# Altium project PilotoAutomatico.PrjPCB
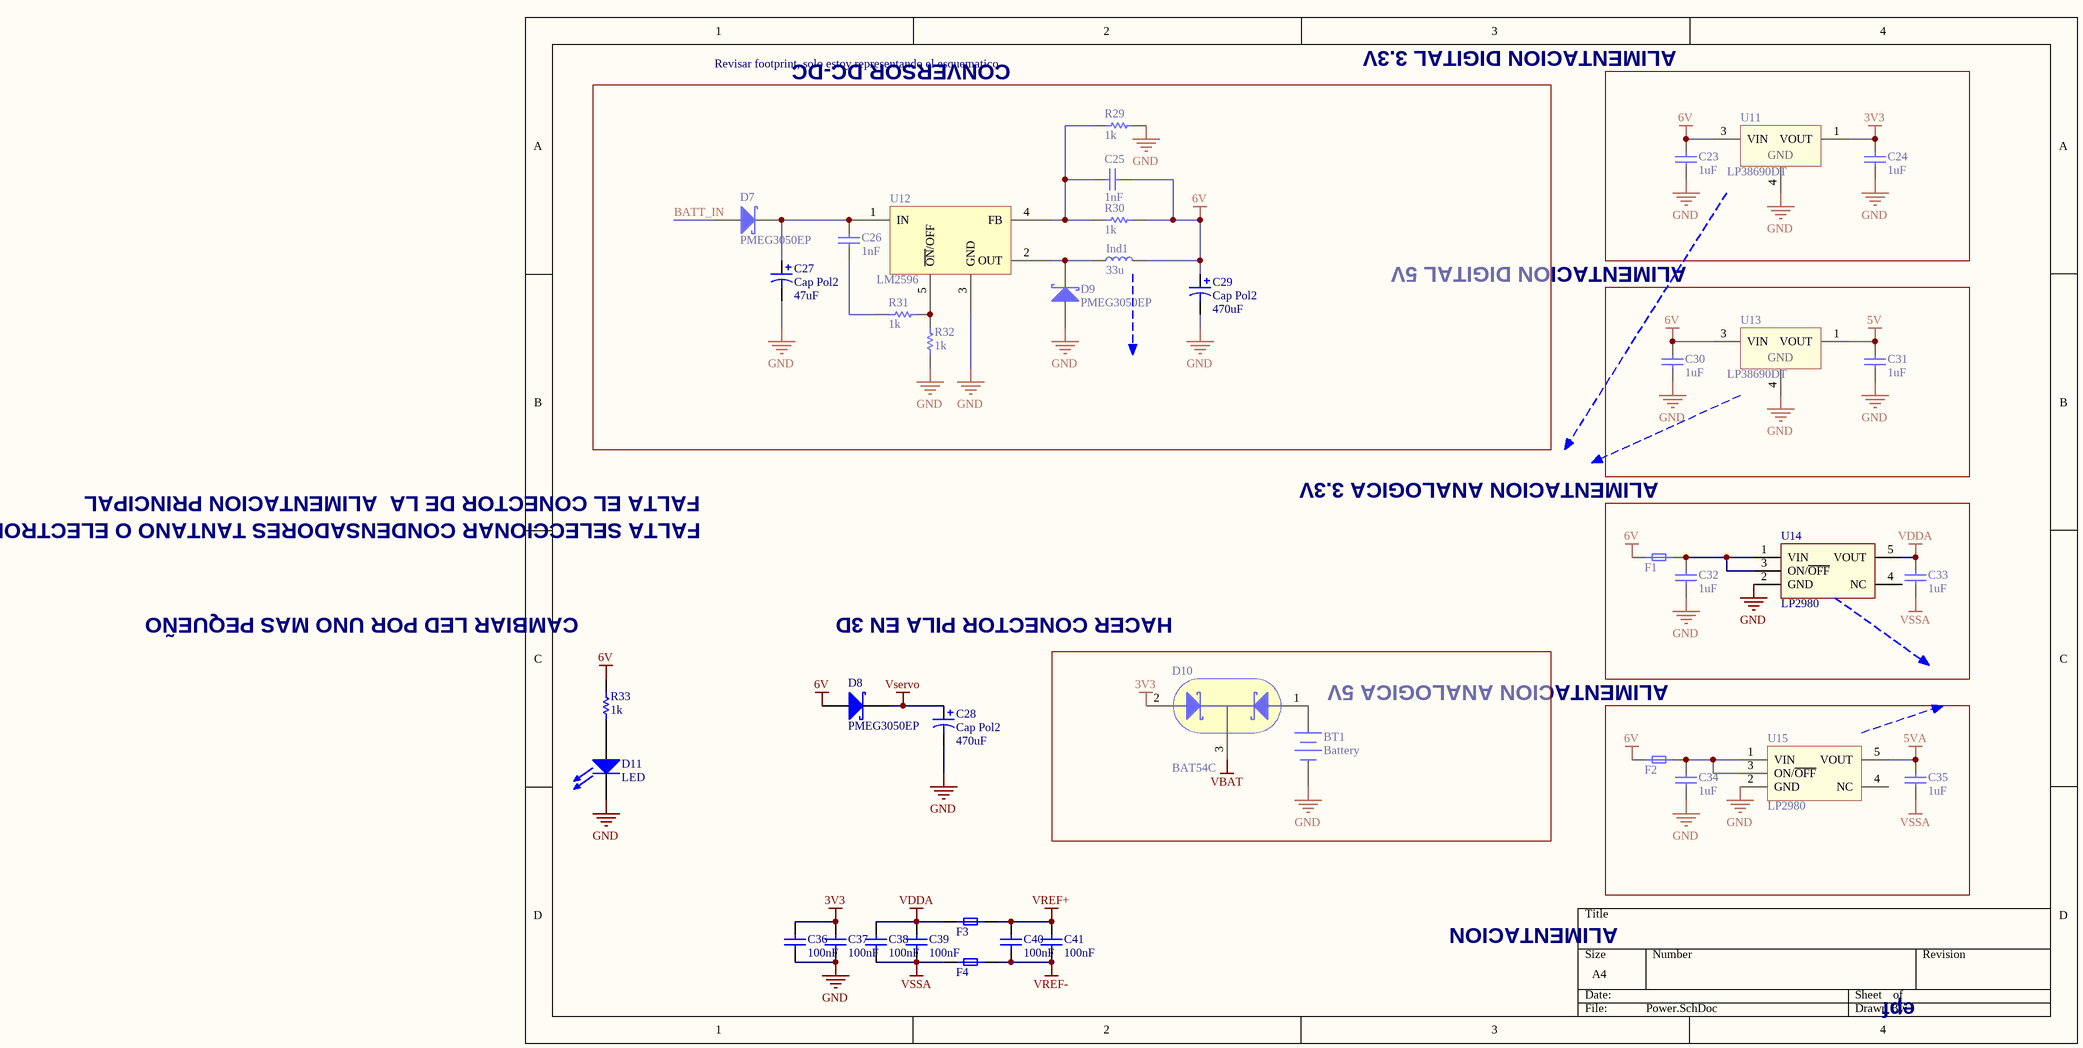
[diagram p0: Power.SchDoc]
autor: epf
6 sheets, 196 parts. Net scope: flat (ports and power ports of the same name join across sheets).
Board files: Autopilot_80x120.PcbDoc, Autopilot_60x120.PcbDoc, Autopilot_v0.PcbDoc
Sheets:
  Power.SchDoc
  Comunicaciones.SchDoc
  RC_Interface.SchDoc
  OSD y Memoria.SchDoc
  Sensores.SchDoc
  SensorDSC.SchDoc

## Sheet Power.SchDoc
size A4

### Parts
BT1  Battery  [BC501SM]
C23  value 1uF  [0805_CAP]  (hidden comment: Capacitor)
C24  value 1uF  [0805_CAP]  (hidden comment: Capacitor)
C25  value 1nF  [0805_CAP]  (hidden comment: Capacitor)
C26  value 1nF  [0805_CAP]  (hidden comment: Capacitor)
C27  Cap Pol2  value 47uF  [TC7360-2924]
C28  Cap Pol2  value 470uF  [TC7360-2924]
C29  Cap Pol2  value 470uF  [TC7360-2924]
C30  value 1uF  [0805_CAP]  (hidden comment: Capacitor)
C31  value 1uF  [0805_CAP]  (hidden comment: Capacitor)
C32  value 1uF  [CAP0402]  (hidden comment: Capacitor)
C33  value 1uF  [CAP0402]  (hidden comment: Capacitor)
C34  value 1uF  [CAP0402]  (hidden comment: Capacitor)
C35  value 1uF  [CAP0402]  (hidden comment: Capacitor)
C36  value 100nF  [CAP0402]  (hidden comment: Capacitor)
C37  value 100nF  [CAP0402]  (hidden comment: Capacitor)
C38  value 100nF  [CAP0402]  (hidden comment: Capacitor)
C39  value 100nF  [CAP0402]  (hidden comment: Capacitor)
C40  value 100nF  [CAP0402]  (hidden comment: Capacitor)
C41  value 100nF  [CAP0402]  (hidden comment: Capacitor)
D7  PMEG3050EP  [SOD128]
D8  PMEG3050EP  [SOD128]
D9  PMEG3050EP  [SOD128]
D10  BAT54C  [SOT23]
D11  LED  [PLCC-2Rojo]
F1  Ferrita  [IND0603]  (value not drawn)
F2  Ferrita  [IND0603]  (value not drawn)
F3  Ferrita  [IND0603]  (value not drawn)
F4  Ferrita  [IND0603]  (value not drawn)
Ind1  Valor: 33u  [CDRH127]  (hidden comment: Ind2)
R29  value 1k  [0805_RES]  (hidden comment: Resistor)
R30  value 1k  [0805_RES]  (hidden comment: Resistor)
R31  value 1k  [0805_RES]  (hidden comment: Resistor)
R32  value 1k  [0805_RES]  (hidden comment: Resistor)
R33  value 1k  [RES0402]  (hidden comment: Resistor)
U11  LP38690DT  [TO252-3N]
U12  LM2596  [TO-263 - LM2596]
U13  LP38690DT  [TO252-3N]
U14  LP2980  [SOT23-5BN]
U15  LP2980  [SOT23-5BN]

### Blocks framed on the sheet
Revisar footprint, solo estoy representando el esquematico: C25-C27 C29 D7 D9 Ind1 R29-R32 U12
ALIMENTACION DIGITAL 5V: C23 C24 U11
ALIMENTACION ANALOGICA 3.3V: C30 C31 U13
ALIMENTACION ANALOGICA 5V: C32 C33 F1 U14

### Nets
3V3: C24.2 C36.2 C37.2 D10.2(NC) U11.1(VOUT)
5V: C31.2 U13.1(VOUT)
5VA: C35.2 U15.5(VOUT)
6V: C23.2 C25.1 C29.1 C30.2 D8.2(A) F1.1 F2.1 Ind1.2 R30.2 R33.1 U11.3(VIN) U13.3(VIN)
GND: BT1.2(-) C23.1 C24.1 C27.2 C28.2 C29.2 C30.1 C31.1 C32.1 C34.1 C36.1 C37.1 D9.2(A) D11.2(K) R29.2 R32.1 U11.4(GND) U12.3(GND) U13.4(GND) U14.2(GND) U15.2(GND)
VBAT: D10.3(K)
VDDA: C33.2 C38.2 C39.2 F3.1 U14.5(VOUT)
VREF+: C40.2 C41.2 F3.2
VREF-: C40.1 C41.1 F4.2
Vservo: C28.1 D8.1(K)
VSSA: C33.1 C35.1 C38.1 C39.1 F4.1
BATT_IN: D7.2(A)
NetBT1_1: BT1.1(+) D10.1(A)
NetC25_2: C25.2 R29.1 R30.1 U12.4(FB)
NetC26_1: C26.1 R31.1
NetC26_2: C26.2 C27.1 D7.1(K) U12.1(IN)
NetC32_2: C32.2 F1.2 U14.1(VIN) U14.3(ON/~{OFF})
NetC34_2: C34.2 F2.2 U15.1(VIN) U15.3(ON/~{OFF})
NetD9_1: D9.1(K) Ind1.1 U12.2(OUT)
NetD11_1: D11.1(A) R33.2
NetR31_2: R31.2 R32.2 U12.5(~{ON}/OFF)

Not connected (* = marked no-connect by the designer): U14 4(NC); U15 4(NC)

### Notes on the sheet
- (near R29) CONVERSOR DC-DC
- ALIMENTACION DIGITAL 3.3V
- FALTA SELECCIONAR CONDENSADORES TANTANO O ELECTROLITICOS
- FALTA EL CONECTOR DE LA  ALIMENTACION PRINCIPAL
- CAMBIAR LED POR UNO MAS PEQUEÑO
- HACER CONECTOR PILA EN 3D
- ALIMENTACION
- epf

### Library data of the parts
BT1 = Battery: Multicell Battery; Published: 24-Mar-1999; LatestRevisionDate: 17-Jul-2002; LatestRevisionNote: Re-released for DXP Platform.; PackageReference: BAT-2; Publisher: Altium Limited
C23-C26 C30-C41 = Cap
C27-C29 = Cap Pol2: Polarized Capacitor (Axial); Published: 8-Jun-2000; LatestRevisionDate: 17-Jul-2002; LatestRevisionNote: Re-released for DXP Platform.; PackageReference: POLAR0.8; Publisher: Altium Limited
D7-D9 = PMEG3050EP: DIODO 5A DC-DC
D10 = BAT54C: Single schottky
D11 = LED1
R29-R33 = Res
U11 U13 = LP38690DT: Current 1A
U14 U15 = LP2980: Current 50mA

## Sheet Comunicaciones.SchDoc
size A4
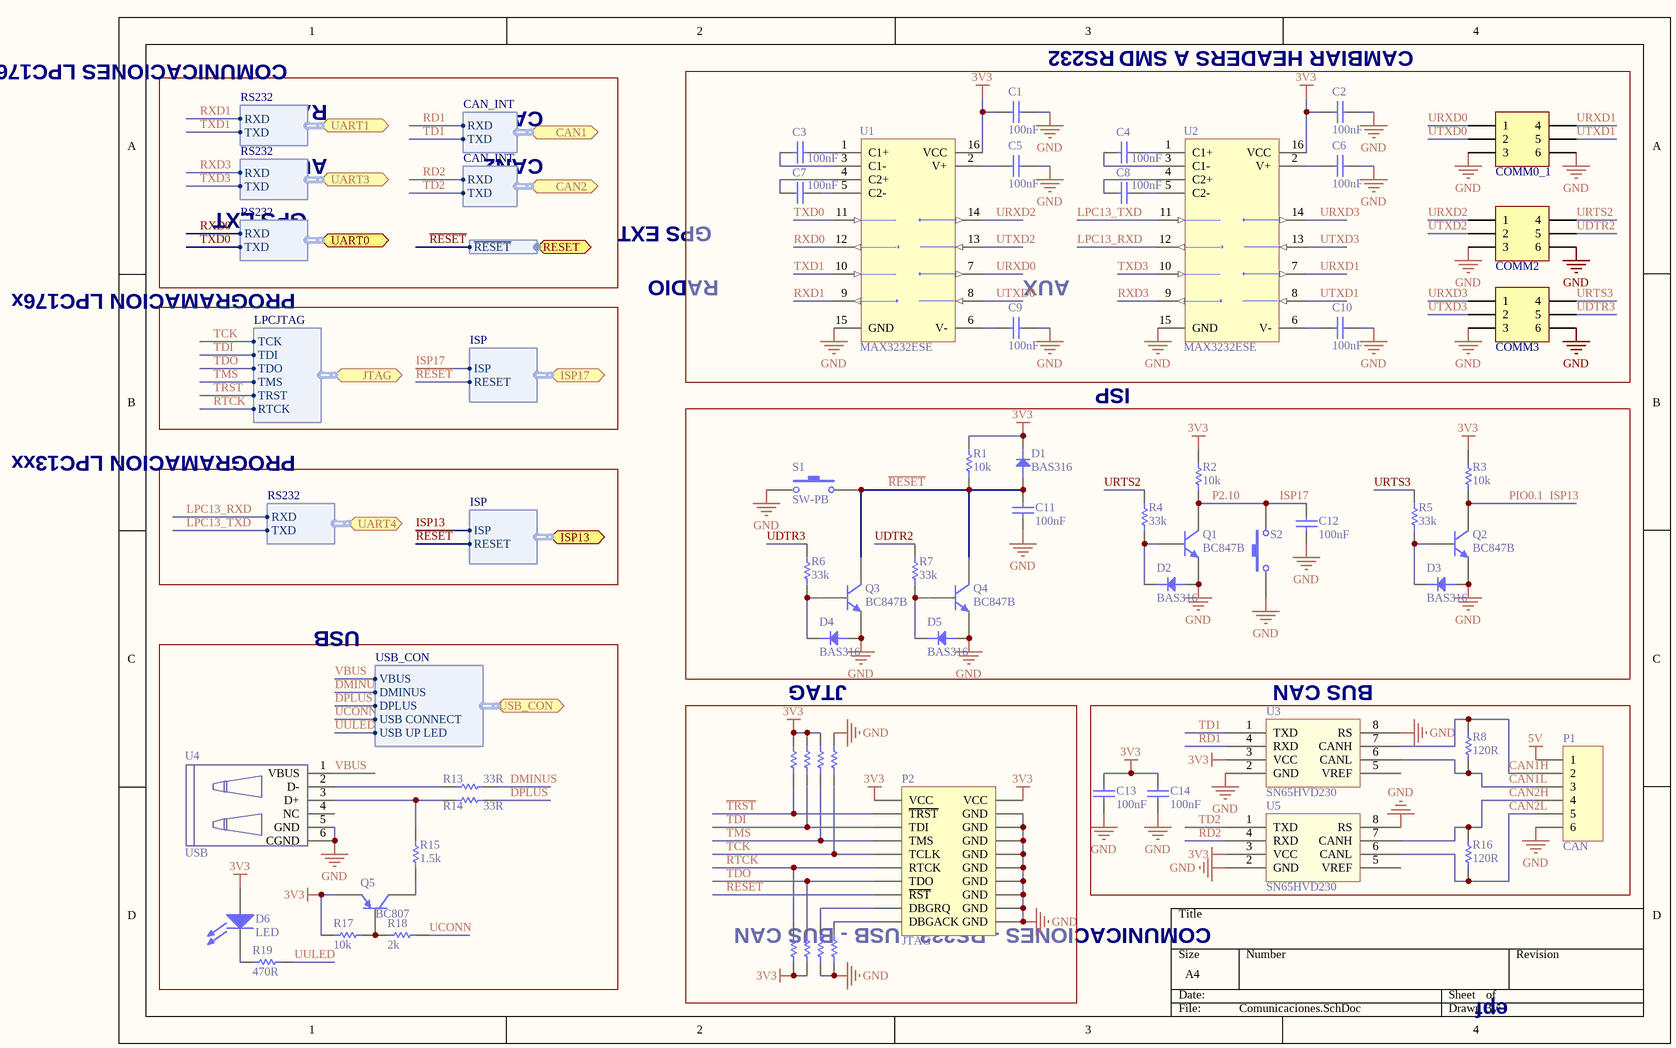
[diagram p1: Comunicaciones.SchDoc]

### Parts
C1  value 100nF  [CAP0402]  (hidden comment: Capacitor)
C2  value 100nF  [CAP0402]  (hidden comment: Capacitor)
C3  value 100nF  [CAP0402]  (hidden comment: Capacitor)
C4  value 100nF  [CAP0402]  (hidden comment: Capacitor)
C5  value 100nF  [CAP0402]  (hidden comment: Capacitor)
C6  value 100nF  [CAP0402]  (hidden comment: Capacitor)
C7  value 100nF  [CAP0402]  (hidden comment: Capacitor)
C8  value 100nF  [CAP0402]  (hidden comment: Capacitor)
C9  value 100nF  [CAP0402]  (hidden comment: Capacitor)
C10  value 100nF  [CAP0402]  (hidden comment: Capacitor)
C11  value 100nF  [CAP0402]  (hidden comment: Capacitor)
C12  value 100nF  [CAP0402]  (hidden comment: Capacitor)
C13  value 100nF  [CAP0402]  (hidden comment: Capacitor)
C14  value 100nF  [CAP0402]  (hidden comment: Capacitor)
COMM0_1  AP_COMM  [HDR2X3_CEN]  (value not drawn)
COMM2  AP_COMM  [HDR2X3_CEN]  (value not drawn)
COMM3  AP_COMM  [HDR2X3_CEN]  (value not drawn)
D1  BAS316  [SOD-323]
D2  BAS316  [SOD-323]
D3  BAS316  [SOD-323]
D4  BAS316  [SOD-323]
D5  BAS316  [SOD-323]
D6  LED  [PLCC-2Rojo]
P1  CAN  [HDR1X6]
P2  JTAG  [HDR2X10]
Q1  BC847B  [SOT23]
Q2  BC847B  [SOT23]
Q3  BC847B  [SOT23]
Q4  BC847B  [SOT23]
Q5  BC807  [SOT23]
R1  value 10k  [RES0402]  (hidden comment: Resistor)
R2  value 10k  [RES0402]  (hidden comment: Resistor)
R3  value 10k  [RES0402]  (hidden comment: Resistor)
R4  value 33k  [RES0402]  (hidden comment: Resistor)
R5  value 33k  [RES0402]  (hidden comment: Resistor)
R6  value 33k  [RES0402]  (hidden comment: Resistor)
R7  value 33k  [RES0402]  (hidden comment: Resistor)
R8  value 120R  [RES0402]  (hidden comment: Resistor)
R9  Resistor  [RES0402]  (value not drawn)
R10  Resistor  [RES0402]  (value not drawn)
R11  Resistor  [RES0402]  (value not drawn)
R12  Resistor  [RES0402]  (value not drawn)
R13  value 33R  [RES0402]  (hidden comment: Resistor)
R14  value 33R  [RES0402]  (hidden comment: Resistor)
R15  value 1.5k  [RES0402]  (hidden comment: Resistor)
R16  value 120R  [RES0402]  (hidden comment: Resistor)
R17  value 10k  [RES0402]  (hidden comment: Resistor)
R18  value 2k  [RES0402]  (hidden comment: Resistor)
R19  value 470R  [RES0402]  (hidden comment: Resistor)
R20  Resistor  [RES0402]  (value not drawn)
R21  Resistor  [RES0402]  (value not drawn)
R22  Resistor  [RES0402]  (value not drawn)
R23  Resistor  [RES0402]  (value not drawn)
S1  SW-PB  [SW-PB6mm - 2]
S2  SW-PB  [SW-PB6mm - 2]  (value not drawn)
U1  MAX3232ESE  [SOIC127P602-16BN]
U2  MAX3232ESE  [SOIC127P602-16BN]
U3  SN65HVD230  [SOIC127P600-8CN]
U4  USB  [USB/SM0.8-6H5]
U5  SN65HVD230  [SOIC127P600-8CN]

### Ports
CAN1 (harness CAN_INT), CAN2 (harness CAN_INT), ISP13 (harness ISP), ISP17 (harness ISP), JTAG (harness LPCJTAG), RESET (harness RESET), UART0 (harness RS232), UART1 (harness RS232), UART3 (harness RS232), UART4 (harness RS232), USB_CON (harness USB_CON)

### Harnesses
RS232: RXD, TXD
CAN_INT: RXD, TXD
LPCJTAG: TCK, TDI, TDO, TMS, TRST, RTCK
ISP: ISP, RESET
USB_CON: DMINUS, DPLUS, VBUS, USB CONNECT, USB UP LED
RESET: ~{RESET}

### Nets
3V3: C1.2 C2.2 C13.2 C14.2 D1.1(K) D6.1(A) P2.1(VCC) P2.2(VCC) Q5.2(E) R1.2 R2.2 R3.2 R9.1 R10.1 R11.1 R17.1 R20.2 R21.2 U1.16(VCC) U2.16(VCC) U3.3(VCC) U5.3(VCC)
5V: P1.1
GND: C1.1 C2.1 C5.1 C6.1 C9.1 C10.1 C11.2 C12.2 C13.1 C14.1 COMM0_1.3 COMM0_1.6 COMM2.3 COMM2.6 COMM3.3 COMM3.6 D2.2(A) D3.2(A) D4.2(A) D5.2(A) P1.6 P2.4(GND) P2.6(GND) P2.8(GND) P2.10(GND) P2.12(GND) P2.14(GND) P2.16(GND) P2.18(GND) P2.20(GND) Q1.2(E) Q2.2(E) Q3.2(E) Q4.2(E) R12.1 R22.2 R23.2 S1.1 S2.1 U1.15(GND) U2.15(GND) U3.2(GND) U3.8(RS) U4.5(GND) U4.6(CGND) U5.2(GND) U5.8(RS)
~{RESET}: C11.1 D1.2(A) P2.15(~{RST}) Q3.3(C) Q4.3(C) R1.1 S1.2 ; port ISP17.RESET, port ISP13.RESET, port RESET.~{RESET}
~{TRST}: P2.3(~{TRST}) R9.2 ; port JTAG.TRST
CAN1H: P1.2 R8.1 U3.7(CANH)
CAN1L: P1.3 R8.2 U3.6(CANL)
CAN2H: P1.4 R16.1 U5.7(CANH)
CAN2L: P1.5 R16.2 U5.6(CANL)
DMINUS: R13.2 ; port USB_CON.DMINUS
DPLUS: R14.2 ; port USB_CON.DPLUS
ISP13: Q2.3(C) R3.1 ; port ISP13.ISP  [also labelled PIO0.1]
ISP17: C12.1 Q1.3(C) R2.1 S2.2 ; port ISP17.ISP  [also labelled P2.10]
LPC13_RXD: U2.12(R1OUT) ; port UART4.RXD
LPC13_TXD: U2.11(T1IN) ; port UART4.TXD
RD1: U3.4(RXD) ; port CAN1.RXD
RD2: U5.4(RXD) ; port CAN2.RXD
RTCK: P2.11(RTCK) R20.1 ; port JTAG.RTCK
RXD0: U1.12(R1OUT) ; port UART0.RXD
RXD1: U1.9(R2OUT) ; port UART1.RXD
RXD3: U2.9(R2OUT) ; port UART3.RXD
TCK: P2.9(TCLK) R12.2 ; port JTAG.TCK
TD1: U3.1(TXD) ; port CAN1.TXD
TD2: U5.1(TXD) ; port CAN2.TXD
TDI: P2.5(TDI) R10.2 ; port JTAG.TDI
TDO: P2.13(TDO) R21.1 ; port JTAG.TDO
TMS: P2.7(TMS) R11.2 ; port JTAG.TMS
TXD0: U1.11(T1IN) ; port UART0.TXD
TXD1: U1.10(T2IN) ; port UART1.TXD
TXD3: U2.10(T2IN) ; port UART3.TXD
UCONN: R18.2 ; port USB_CON.USB CONNECT  [project net RXD2]
UDTR2: COMM2.5 R7.2
UDTR3: COMM3.5 R6.2
URTS2: COMM2.4 R4.2
URTS3: COMM3.4 R5.2
URXD0: COMM0_1.1 U1.7(T2OUT)
URXD1: COMM0_1.4 U2.7(T2OUT)
URXD2: COMM2.1 U1.14(T1OUT)
URXD3: COMM3.1 U2.14(T1OUT)
UTXD0: COMM0_1.2 U1.8(R2IN)
UTXD1: COMM0_1.5 U2.8(R2IN)
UTXD2: COMM2.2 U1.13(R1IN)
UTXD3: COMM3.2 U2.13(R1IN)
UULED: R19.2 ; port USB_CON.USB UP LED
VBUS: U4.1(VBUS) ; port USB_CON.VBUS
NetC3_1: C3.1 U1.1(C1+)
NetC3_2: C3.2 U1.3(C1-)
NetC4_1: C4.1 U2.1(C1+)
NetC4_2: C4.2 U2.3(C1-)
NetC5_2: C5.2 U1.2(V+)
NetC6_2: C6.2 U2.2(V+)
NetC7_1: C7.1 U1.5(C2-)
NetC7_2: C7.2 U1.4(C2+)
NetC8_1: C8.1 U2.5(C2-)
NetC8_2: C8.2 U2.4(C2+)
NetC9_2: C9.2 U1.6(V-)
NetC10_2: C10.2 U2.6(V-)
NetD2_1: D2.1(K) Q1.1(B) R4.1
NetD3_1: D3.1(K) Q2.1(B) R5.1
NetD4_1: D4.1(K) Q3.1(B) R6.1
NetD5_1: D5.1(K) Q4.1(B) R7.1
NetD6_2: D6.2(K) R19.1
NetP2_17: P2.17(DBGRQ) R22.1
NetP2_19: P2.19(DBGACK) R23.1
NetQ5_1: Q5.1(B) R17.2 R18.1
NetQ5_3: Q5.3(C) R15.2
NetR13_1: R13.1 U4.2(D-)
NetR14_1: R14.1 R15.1 U4.3(D+)

Not connected (* = marked no-connect by the designer): U3 5(VREF); U4 4(NC); U5 5(VREF)

### Notes on the sheet
- COMUNICACIONES LPC176x
- RS232
- CAMBIAR HEADERS A SMD
- RADIO
- CAN1
- AUX
- CAN2
- GPS EXT
- (near C7) GPS EXT
- PROGRAMACION LPC176x
- ISP
- PROGRAMACION LPC13xx
- USB
- JTAG
- BUS CAN
- COMUNICACIONES - RS232 - USB - BUS CAN
- epf

### Library data of the parts
C1-C14 = Cap
COMM0_1 COMM2 COMM3 = AP_COMM: Header, 3-Pin, Dual row; LatestRevisionDate: 17-Jul-2002; LatestRevisionNote: Re-released for DXP Platform.; Publisher: Altium Limited
D6 = LED1
P1 = CAN_Conn: Header, 6-Pin; LatestRevisionDate: 17-Jul-2002; LatestRevisionNote: Re-released for DXP Platform.; Publisher: Altium Limited
P2 = JTAG: Header, 10-Pin, Dual row; LatestRevisionDate: 17-Jul-2002; LatestRevisionNote: Re-released for DXP Platform.; Publisher: Altium Limited
Q1-Q4 = BC847B: NPN 100MHz
Q5 = BC807: PNP 100MHz
R1-R8 R13-R19 = Res
R9-R12 R20-R23 = Res: Value: 10k
S1 S2 = SW-PB: Switch; Published: 24-Mar-1999; LatestRevisionDate: 17-Jul-2002; LatestRevisionNote: Re-released for DXP Platform.; PackageReference: SPST-2; Publisher: Altium Limited
U1 U2 = MAX3232ESE+
U3 U5 = SN65HVD230: 3.3-V CAN TRANSCEIVERS
U4 = USB-miniB

## Sheet RC_Interface.SchDoc
size A4
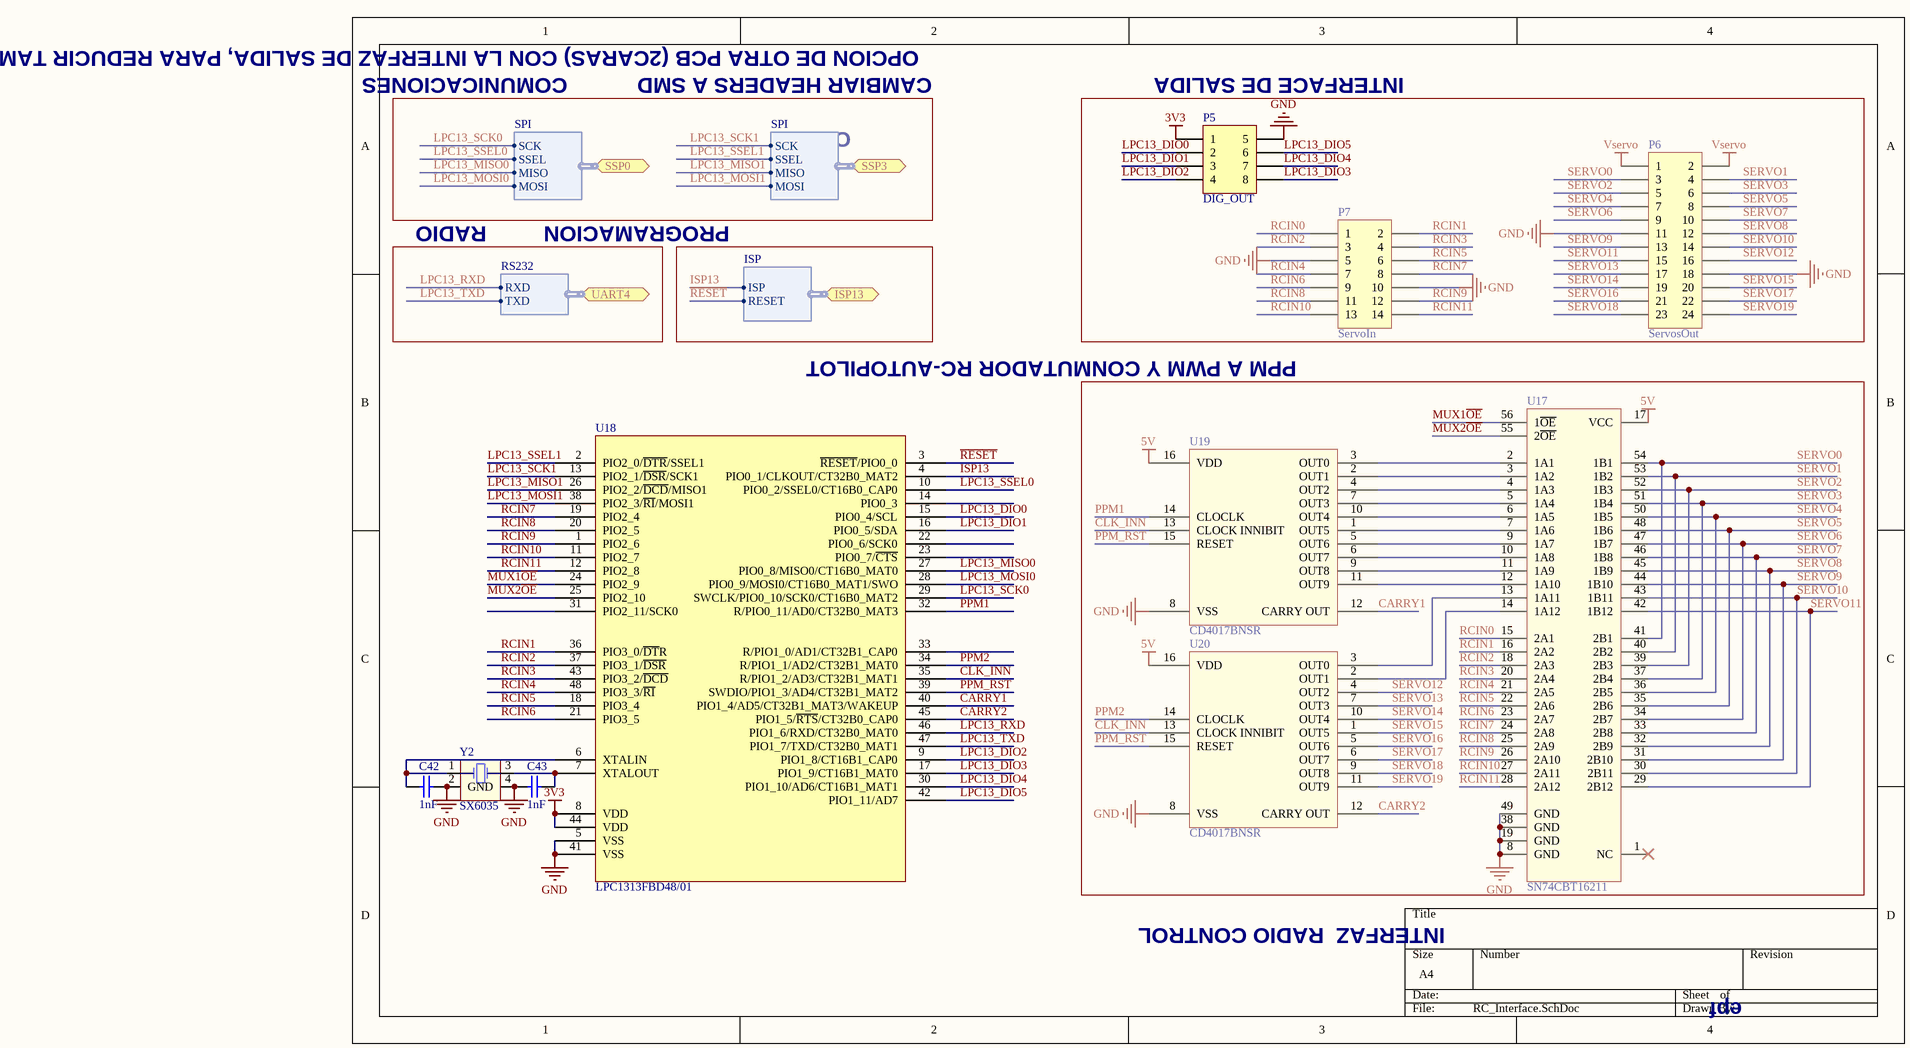
[diagram p2: RC_Interface.SchDoc]

### Parts
C42  value 1nF  [CAP0402]  (hidden comment: Capacitor)
C43  value 1nF  [CAP0402]  (hidden comment: Capacitor)
P5  DIG_OUT  [HDR2X4_CEN]
P6  ServosOut  [HDR 2X12]
P7  ServoIn  [HDR2X7]
U17  SN74CBT16211  [SOP635P1035-56N]
U18  LPC1313FBD48/01  [TQFP48_LPC1343]
U19  CD4017BNSR  [SOIC127P602-16BN]
U20  CD4017BNSR  [SOIC127P602-16BN]
Y2  SX6035  [SX6035]

### Ports
ISP13 (harness ISP), SSP0 (harness SPI), SSP3 (harness SPI), UART4 (harness RS232)

### Harnesses
SPI: SCK, SSEL, MISO, MOSI
RS232: RXD, TXD
ISP: ISP, RESET

### Nets
3V3: P5.1 U18.8(VDD) U18.44(VDD)
5V: U17.17(VCC) U19.16(VDD) U20.16(VDD)
GND: C42.1 C43.2 P5.5 P6.11 P6.18 P7.5 P7.10 U17.8(GND) U17.19(GND) U17.38(GND) U17.49(GND) U18.5(VSS) U18.41(VSS) U19.8(VSS) U20.8(VSS) Y2.2(GND) Y2.4(GND)
Vservo: P6.1 P6.2
~{RESET}: U18.3(~{RESET}/PIO0_0) ; port ISP13.RESET
CARRY1: U18.40(PIO1_4/AD5/CT32B1_MAT3/WAKEUP) U19.12(CARRY_OUT)
CARRY2: U18.45(PIO1_5/~{RTS}/CT32B0_CAP0) U20.12(CARRY_OUT)
CLK_INN: U18.35(R/PIO1_2/AD3/CT32B1_MAT1) U19.13(CLOCK_INNIBIT) U20.13(CLOCK_INNIBIT)
ISP13: U18.4(PIO0_1/CLKOUT/CT32B0_MAT2) ; port ISP13.ISP
LPC13_DIO0: P5.2 U18.15(PIO0_4/SCL)
LPC13_DIO1: P5.3 U18.16(PIO0_5/SDA)
LPC13_DIO2: P5.4 U18.9(PIO1_8/CT16B1_CAP0)
LPC13_DIO3: P5.8 U18.17(PIO1_9/CT16B1_MAT0)
LPC13_DIO4: P5.7 U18.30(PIO1_10/AD6/CT16B1_MAT1)
LPC13_DIO5: P5.6 U18.42(PIO1_11/AD7)
LPC13_MISO0: U18.27(PIO0_8/MISO0/CT16B0_MAT0) ; port SSP0.MISO
LPC13_MISO1: U18.26(PIO2_2/~{DCD}/MISO1) ; port SSP3.MISO
LPC13_MOSI0: U18.28(PIO0_9/MOSI0/CT16B0_MAT1/SWO) ; port SSP0.MOSI
LPC13_MOSI1: U18.38(PIO2_3/~{RI}/MOSI1) ; port SSP3.MOSI
LPC13_RXD: U18.46(PIO1_6/RXD/CT32B0_MAT0) ; port UART4.RXD
LPC13_SCK0: U18.29(SWCLK/PIO0_10/SCK0/CT16B0_MAT2) ; port SSP0.SCK
LPC13_SCK1: U18.13(PIO2_1/~{DSR}/SCK1) ; port SSP3.SCK
LPC13_SSEL0: U18.10(PIO0_2/SSEL0/CT16B0_CAP0) ; port SSP0.SSEL
LPC13_SSEL1: U18.2(PIO2_0/~{DTR}/SSEL1) ; port SSP3.SSEL
LPC13_TXD: U18.47(PIO1_7/TXD/CT32B0_MAT1) ; port UART4.TXD
MUX1~{OE}: U17.56(1~{OE}) U18.24(PIO2_9)
MUX2~{OE}: U17.55(2~{OE}) U18.25(PIO2_10)
PPM1: U18.32(R/PIO0_11/AD0/CT32B0_MAT3) U19.14(CLOCLK)
PPM2: U18.34(R/PIO1_1/AD2/CT32B1_MAT0) U20.14(CLOCLK)
PPM_RST: U18.39(SWDIO/PIO1_3/AD4/CT32B1_MAT2) U19.15(RESET) U20.15(RESET)
RCIN0: P7.1 U17.15(2A1)
RCIN1: P7.2 U17.16(2A2) U18.36(PIO3_0/~{DT}R)
RCIN2: P7.3 U17.18(2A3) U18.37(PIO3_1/~{DSR})
RCIN3: P7.4 U17.20(2A4) U18.43(PIO3_2/~{DCD})
RCIN4: P7.7 U17.21(2A5) U18.48(PIO3_3/~{RI})
RCIN5: P7.6 U17.22(2A6) U18.18(PIO3_4)
RCIN6: P7.9 U17.23(2A7) U18.21(PIO3_5)
RCIN7: P7.8 U17.24(2A8) U18.19(PIO2_4)
RCIN8: P7.11 U17.25(2A9) U18.20(PIO2_5)
RCIN9: P7.12 U17.26(2A10) U18.1(PIO2_6)
RCIN10: P7.13 U17.27(2A11) U18.11(PIO2_7)
RCIN11: P7.14 U17.28(2A12) U18.12(PIO2_8)
SERVO0: P6.3 U17.41(2B1) U17.54(1B1)
SERVO1: P6.4 U17.40(2B2) U17.53(1B2)
SERVO2: P6.5 U17.39(2B3) U17.52(1B3)
SERVO3: P6.6 U17.37(2B4) U17.51(1B4)
SERVO4: P6.7 U17.36(2B5) U17.50(1B5)
SERVO5: P6.8 U17.35(2B6) U17.48(1B6)
SERVO6: P6.9 U17.34(2B7) U17.47(1B7)
SERVO7: P6.10 U17.33(2B8) U17.46(1B8)
SERVO8: P6.12 U17.32(2B9) U17.45(1B9)
SERVO9: P6.13 U17.31(2B10) U17.44(1B10)
SERVO10: P6.14 U17.30(2B11) U17.43(1B11)
SERVO11: P6.15 U17.29(2B12) U17.42(1B12)
SERVO12: P6.16 U20.4(OUT2)
SERVO13: P6.17 U20.7(OUT3)
SERVO14: P6.19 U20.10(OUT4)
SERVO15: P6.20 U20.1(OUT5)
SERVO16: P6.21 U20.5(OUT6)
SERVO17: P6.22 U20.6(OUT7)
SERVO18: P6.23 U20.9(OUT8)
SERVO19: P6.24 U20.11(OUT9)
NetC42_2: C42.2 U18.6(XTALIN) Y2.1(XTAL)
NetC43_1: C43.1 U18.7(XTALOUT) Y2.3(XTAL)
NetU17_2: U17.2(1A1) U19.3(OUT0)
NetU17_3: U17.3(1A2) U19.2(OUT1)
NetU17_4: U17.4(1A3) U19.4(OUT2)
NetU17_5: U17.5(1A4) U19.7(OUT3)
NetU17_6: U17.6(1A5) U19.10(OUT4)
NetU17_7: U17.7(1A6) U19.1(OUT5)
NetU17_9: U17.9(1A7) U19.5(OUT6)
NetU17_10: U17.10(1A8) U19.6(OUT7)
NetU17_11: U17.11(1A9) U19.9(OUT8)
NetU17_12: U17.12(1A10) U19.11(OUT9)
NetU17_13: U17.13(1A11) U20.3(OUT0)
NetU17_14: U17.14(1A12) U20.2(OUT1)

Not connected (* = marked no-connect by the designer): U17 1(NC)*; U18 14(PIO0_3) 22(PIO0_6/SCK0) 23(PIO0_7/~{CTS}) 31(PIO2_11/SCK0) 33(R/PIO1_0/AD1/CT32B1_CAP0)

### Notes on the sheet
- OPCION DE OTRA PCB (2CARAS) CON LA INTERFAZ DE SALIDA, PARA REDUCIR TAMAÑO
- COMUNICACIONES
- OSD
- CAMBIAR HEADERS A SMD
- INTERFACE DE SALIDA
- LPC17
- RADIO
- PROGRAMACION
- PPM A PWM Y CONMUTADOR RC-AUTOPILOT
- INTERFAZ  RADIO CONTROL
- epf

### Library data of the parts
C42 C43 = Cap
P5 = AP_SALIDA_DIGITAL: Header, 4-Pin, Dual row; LatestRevisionDate: 17-Jul-2002; LatestRevisionNote: Re-released for DXP Platform.; Publisher: Altium Limited
P6 = ServosOut: Header, 12-Pin, Dual row; LatestRevisionDate: 17-Jul-2002; LatestRevisionNote: Re-released for DXP Platform.; Publisher: Altium Limited
P7 = ServoIn: Header, 7-Pin, Dual row; LatestRevisionDate: 17-Jul-2002; LatestRevisionNote: Re-released for DXP Platform.; Publisher: Altium Limited
U17 = SN74CBT16211: MUX
U18 = LPC1313FBD48/01: ARM CortexM3 32K Flash, 8k RAM
U19 U20 = CD4017BNSR: COUNTER/DIVIDERS
Y2 = XTAL_SX6035

## Sheet OSD y Memoria.SchDoc
size A4
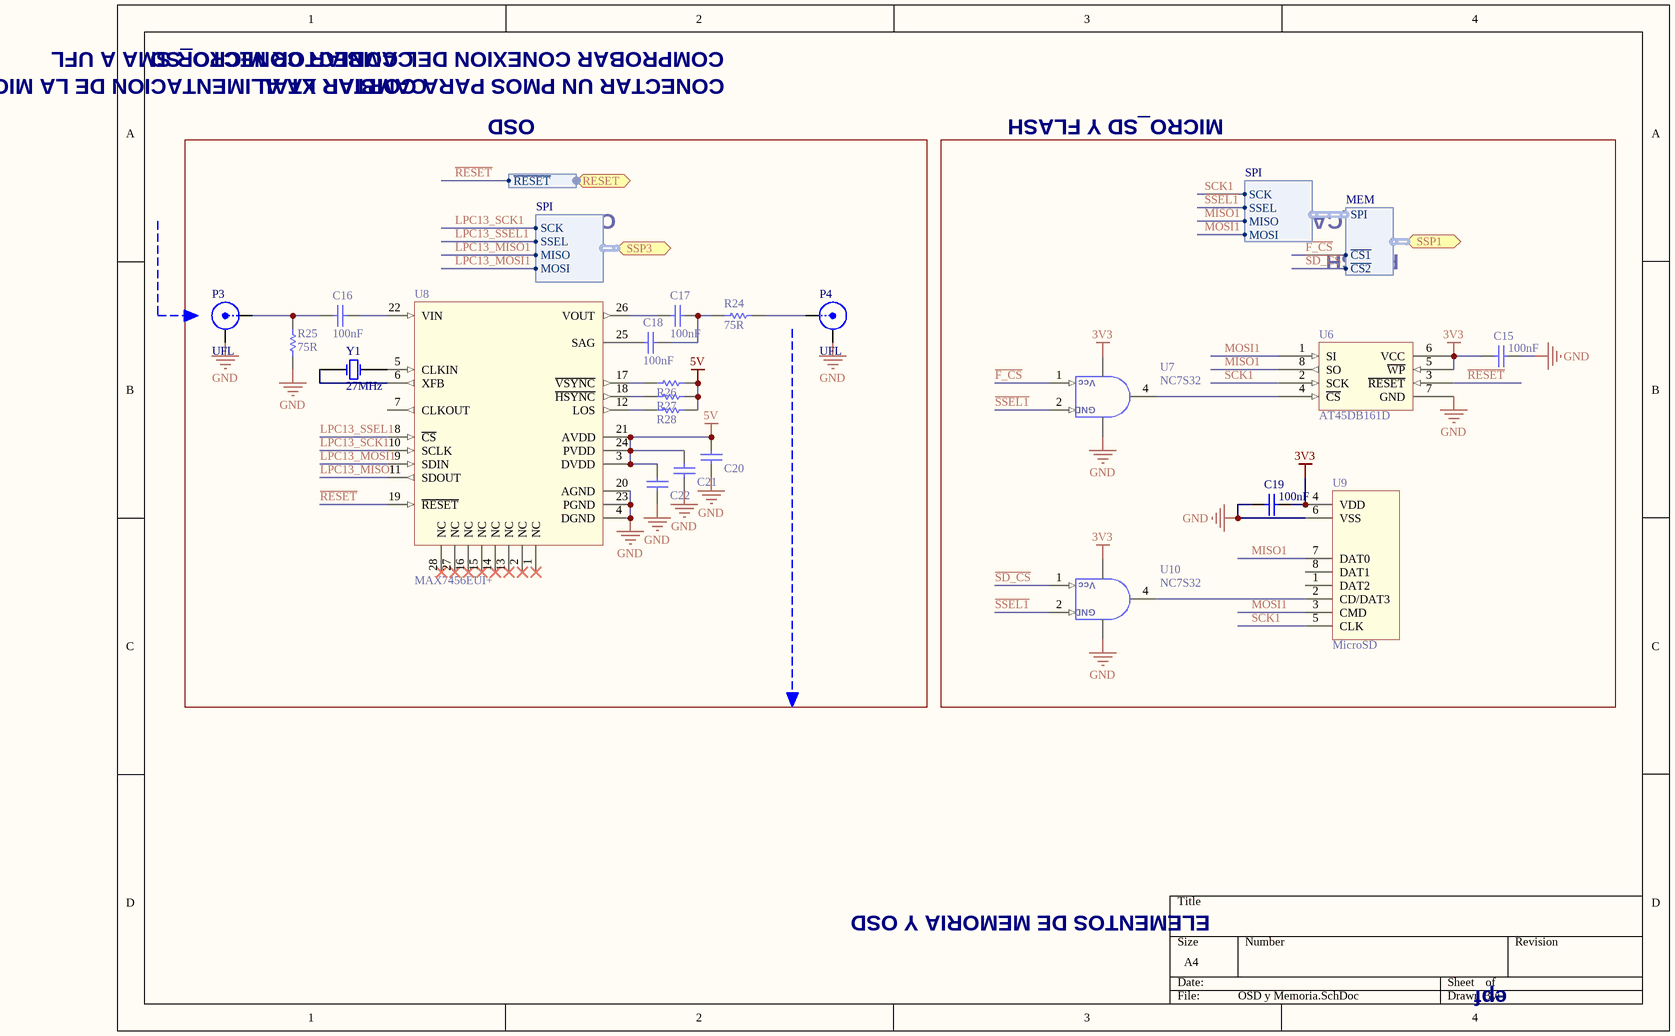
[diagram p3: OSD y Memoria.SchDoc]

### Parts
C15  value 100nF  [CAP0402]  (hidden comment: Capacitor)
C16  value 100nF  [CAP0402]  (hidden comment: Capacitor)
C17  value 100nF  [CAP0402]  (hidden comment: Capacitor)
C18  value 100nF  [CAP0402]  (hidden comment: Capacitor)
C19  value 100nF  [CAP0402]  (hidden comment: Capacitor)
C20  Capacitor  [CAP0402]  (value not drawn)
C21  Capacitor  [CAP0402]  (value not drawn)
C22  Capacitor  [CAP0402]  (value not drawn)
P3  UFL  [UFL]
P4  UFL  [UFL]
R24  value 75R  [RES0402]  (hidden comment: Resistor)
R25  value 75R  [RES0402]  (hidden comment: Resistor)
R26  Resistor  [RES0402]  (value not drawn)
R27  Resistor  [RES0402]  (value not drawn)
R28  Resistor  [RES0402]  (value not drawn)
U6  AT45DB161D  [SOIC127P600-8CN]
U7  NC7S32  [SOT23-5BN]
U8  MAX7456EUI+  [TSOP65P640-28AN]
U9  MicroSD  [101-00303]
U10  NC7S32  [SOT23-5BN]
Y1  27MHz  [HC/49US]

### Blocks framed on the sheet
OSD: C16-C18 C20-C22 P3 P4 R24-R28 U8 Y1

### Ports
RESET (harness RESET), SSP1 (harness MEM), SSP3 (harness SPI)

### Harnesses
SPI: SCK, SSEL, MISO, MOSI
RESET: ~{RESET}
MEM: SPI, ~{CS1}, ~{CS2}

### Nets
3V3: C15.1 C19.2 U6.5(~{WP}) U6.6(VCC) U7.5(VCC) U9.4(VDD) U10.5(VCC)
5V: C20.2 C21.2 C22.2 R26.2 R27.2 R28.2 U8.3(DVDD) U8.21(AVDD) U8.24(PVDD)
GND: C15.2 C19.1 C20.1 C21.1 C22.1 P3.2(Y) P4.2(Y) R25.1 U6.7(GND) U7.3(GND) U8.4(DGND) U8.20(AGND) U8.23(PGND) U9.6(VSS) U10.3(GND)
~{F_CS}: U7.1(A) ; port SSP1.~{CS1}
~{RESET}: U6.3(~{RESET}) U8.19(~{RESET}) ; port RESET.~{RESET}
~{SD_CS}: U10.1(A) ; port SSP1.~{CS2}
~{SSEL1}: U7.2(B) U10.2(B) ; harness SPI.SSEL
LPC13_MISO1: U8.11(SDOUT) ; port SSP3.MISO
LPC13_MOSI1: U8.9(SDIN) ; port SSP3.MOSI
LPC13_SCK1: U8.10(SCLK) ; port SSP3.SCK
LPC13_SSEL1: U8.8(~{CS}) ; port SSP3.SSEL
MISO1: U6.8(SO) U9.7(DAT0) ; harness SPI.MISO
MOSI1: U6.1(SI) U9.3(CMD) ; harness SPI.MOSI
SCK1: U6.2(SCK) U9.5(CLK) ; harness SPI.SCK
NetC16_1: C16.1 U8.22(VIN)
NetC16_2: C16.2 P3.1(X) R25.2
NetC17_1: C17.1 C18.1 R24.1
NetC17_2: C17.2 U8.26(VOUT)
NetC18_2: C18.2 U8.25(SAG)
NetP4_1: P4.1(X) R24.2
NetR26_1: R26.1 U8.17(~{VSYNC})
NetR27_1: R27.1 U8.18(~{HSYNC})
NetR28_1: R28.1 U8.12(LOS)
NetU6_4: U6.4(~{CS}) U7.4(Y)
NetU8_5: U8.5(CLKIN) Y1.2(OSC2)
NetU8_6: U8.6(XFB) Y1.1(OSC1)
NetU9_2: U9.2(CD/DAT3) U10.4(Y)

Not connected (* = marked no-connect by the designer): U8 1(NC)* 2(NC)* 7(CLKOUT) 13(NC)* 14(NC)* 15(NC)* 16(NC)* 27(NC)* 28(NC)*; U9 1(DAT2) 8(DAT1)

### Notes on the sheet
- CAMBIAR CONECTOR SMA A UFL
- COMPROBAR CONEXION DEL CONECTOR MICRO_SD
- CAMBIAR XTAL
- OSD
- CONECTAR UN PMOS PARA CORTAR LA ALIMENTACION DE LA MICROSD
- MICRO_SD Y FLASH
- SD_CARD
- FLASH
- ELEMENTOS DE MEMORIA Y OSD
- epf
- (in symbol NC7S32) Vcc

### Library data of the parts
C15-C19 = Cap
C20-C22 = Cap: Value: 100nF
R24 R25 = Res
R26-R28 = Res: Value: 1k
U6 = AT45DB161D: Data Flash
U7 U10 = NC7S32: OR GATE
U8 = MAX7456EUI+: OSD Display
Y1 = XTAL: Crystal Oscillator; Published: 8-Jun-2000; LatestRevisionDate: 17-Jul-2002; LatestRevisionNote: Re-released for DXP Platform.; PackageReference: R38; Publisher: Altium Limited

## Sheet Sensores.SchDoc
size A4
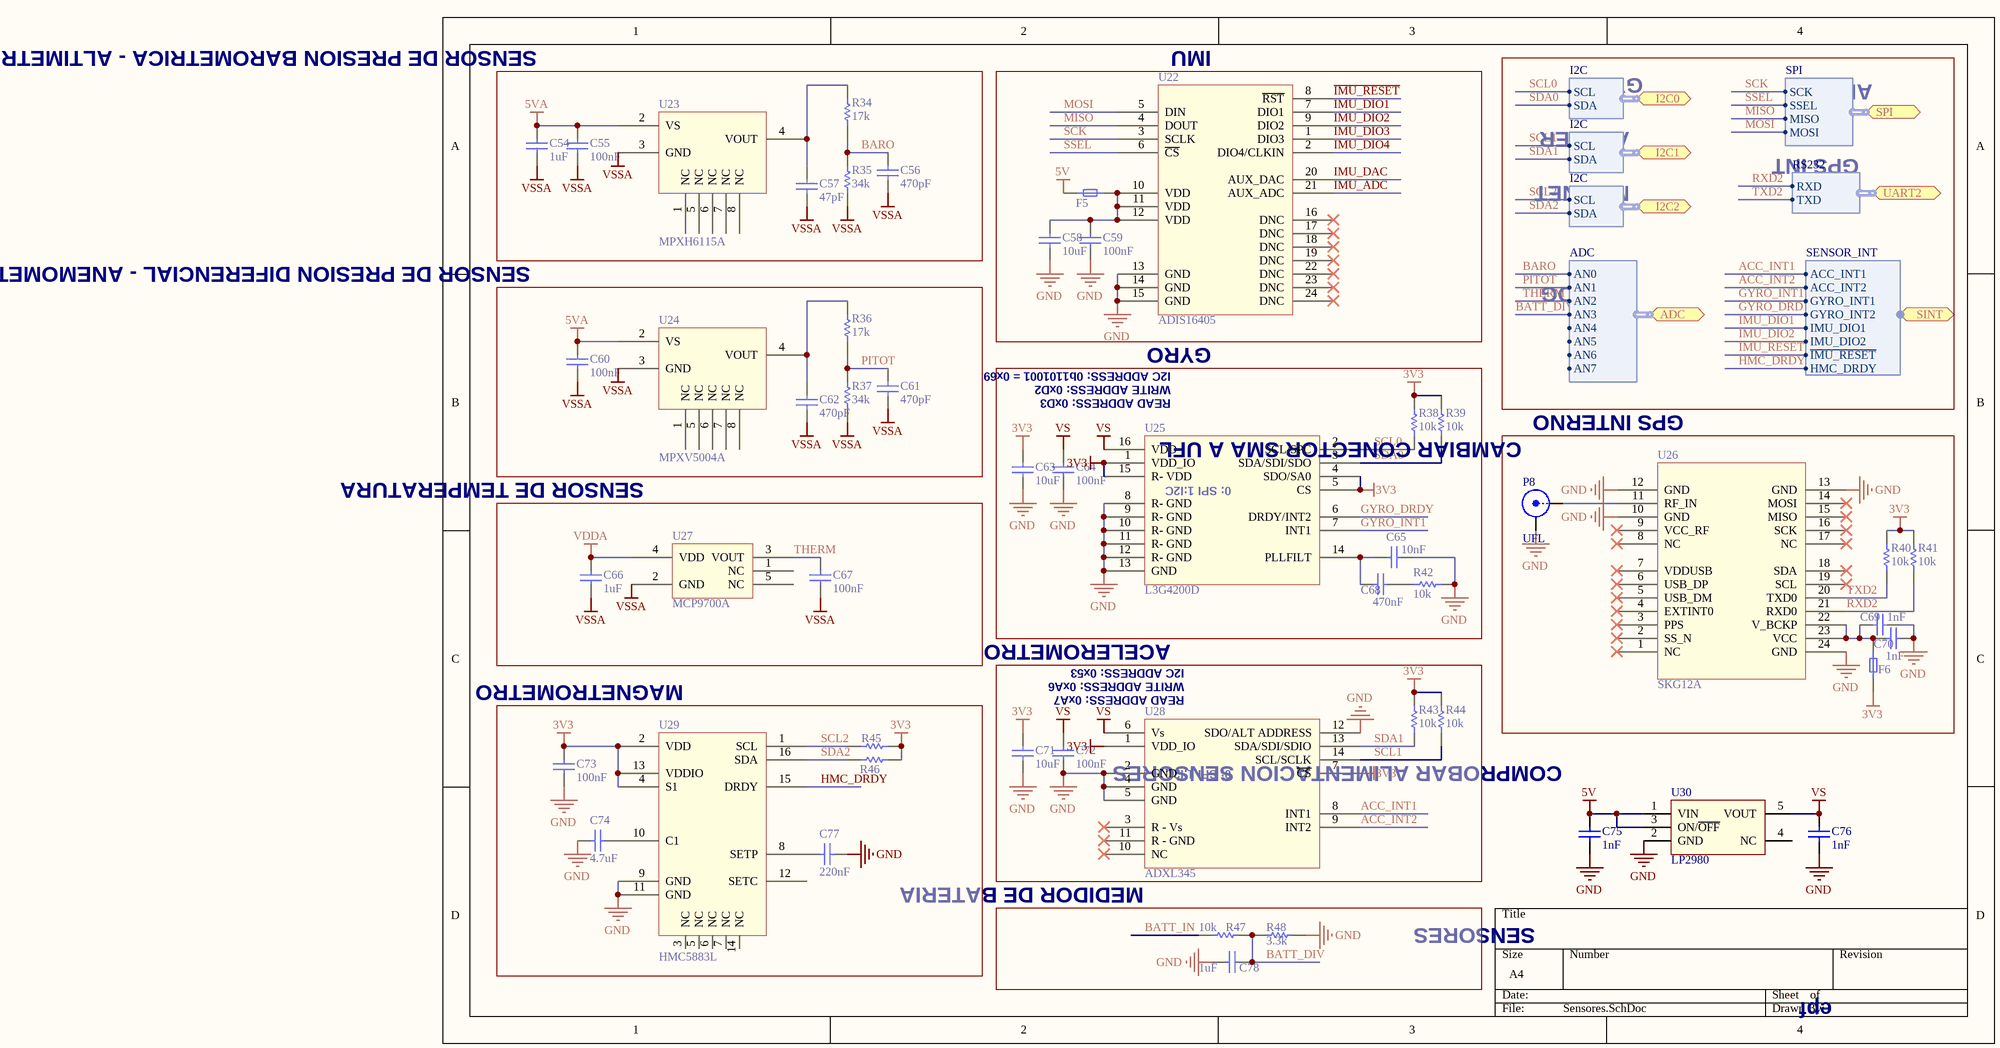
[diagram p4: Sensores.SchDoc]

### Parts
C54  value 1uF  [CAP0402]  (hidden comment: Capacitor)
C55  value 100nF  [CAP0402]  (hidden comment: Capacitor)
C56  value 470pF  [CAP0402]  (hidden comment: Capacitor)
C57  value 47pF  [CAP0402]  (hidden comment: Capacitor)
C58  value 10uF  [CAP0402]  (hidden comment: Capacitor)
C59  value 100nF  [CAP0402]  (hidden comment: Capacitor)
C60  value 100nF  [CAP0402]  (hidden comment: Capacitor)
C61  value 470pF  [CAP0402]  (hidden comment: Capacitor)
C62  value 470pF  [CAP0402]  (hidden comment: Capacitor)
C63  value 10uF  [CAP0402]  (hidden comment: Capacitor)
C64  value 100nF  [CAP0402]  (hidden comment: Capacitor)
C65  value 10nF  [CAP0402]  (hidden comment: Capacitor)
C66  value 1uF  [CAP0402]  (hidden comment: Capacitor)
C67  value 100nF  [CAP0402]  (hidden comment: Capacitor)
C68  value 470nF  [CAP0402]  (hidden comment: Capacitor)
C69  value 1nF  [CAP0402]  (hidden comment: Capacitor)
C70  value 1nF  [CAP0402]  (hidden comment: Capacitor)
C71  value 10uF  [CAP0402]  (hidden comment: Capacitor)
C72  value 100nF  [CAP0402]  (hidden comment: Capacitor)
C73  value 100nF  [CAP0402]  (hidden comment: Capacitor)
C74  value 4.7uF  [CAP0402]  (hidden comment: Capacitor)
C75  value 1nF  [CAP0402]  (hidden comment: Capacitor)
C76  value 1nF  [CAP0402]  (hidden comment: Capacitor)
C77  value 220nF  [CAP0402]  (hidden comment: Capacitor)
C78  value 1uF  [CAP0402]  (hidden comment: Capacitor)
F5  Ferrita  [IND0603]  (value not drawn)
F6  Ferrita  [IND0603]  (value not drawn)
P8  UFL  [UFL]
R34  value 17k  [RES0402]  (hidden comment: Resistor)
R35  value 34k  [RES0402]  (hidden comment: Resistor)
R36  value 17k  [RES0402]  (hidden comment: Resistor)
R37  value 34k  [RES0402]  (hidden comment: Resistor)
R38  value 10k  [RES0402]  (hidden comment: Resistor)
R39  value 10k  [RES0402]  (hidden comment: Resistor)
R40  value 10k  [RES0402]  (hidden comment: Resistor)
R41  value 10k  [RES0402]  (hidden comment: Resistor)
R42  value 10k  [RES0402]  (hidden comment: Resistor)
R43  value 10k  [RES0402]  (hidden comment: Resistor)
R44  value 10k  [RES0402]  (hidden comment: Resistor)
R45  Resistor  [RES0402]  (value not drawn)
R46  Resistor  [RES0402]  (value not drawn)
R47  value 10k  [RES0402]  (hidden comment: Resistor)
R48  value 3.3k  [RES0402]  (hidden comment: Resistor)
U22  ADIS16405  [ADIS16405]
U23  MPXH6115A  [SSOP1317]
U24  MPXV5004A  [SSOP1351 - MPXV5004DP]
U25  L3G4200D  [QFN65P400X400-16 - L3G4200D]
U26  SKG12A  [SKG12A]
U27  MCP9700A  [SOT353-5AN]
U28  ADXL345  [LGA80P500X300-14N]
U29  HMC5883L  [QFN50P300X300-16-HMC]
U30  LP2980  [SOT23-5BN]

### Blocks framed on the sheet
SENSOR DE PRESION DIFERENCIAL - ANEMOMETRO: C54-C57 R34 R35 U23
GYRO: C58 C59 F5 U22
SENSOR DE TEMPERATURA: C60-C62 R36 R37 U24
ACELEROMETRO: C63-C65 C68 R38 R39 R42 U25
CAMBIAR CONECTOR SMA A UFL: C69 C70 F6 P8 R40 R41 U26
MEDIDOR DE BATERIA: C71 C72 R43 R44 U28

### Ports
ADC (harness ADC), I2C0 (harness I2C), I2C1 (harness I2C), I2C2 (harness I2C), SINT (harness SENSOR_INT), SPI (harness SPI), UART2 (harness RS232)

### Harnesses
I2C: SCL, SDA
ADC: AN0, AN1, AN2, AN3, AN4, AN5, AN6, AN7
RS232: RXD, TXD
SPI: SCK, SSEL, MISO, MOSI
SENSOR_INT: ACC_INT1, ACC_INT2, GYRO_INT1, GYRO_INT2, IMU_DIO1, IMU_DIO2, ~{IMU_RESET}, HMC_DRDY

### Nets
3V3: C63.2 C71.2 C73.1 F6.1 R38.1 R39.1 R40.1 R41.1 R43.1 R44.1 R45.2 R46.2 U25.1(VDD_IO) U25.4(SDO/SA0) U25.5(CS) U25.15(R-_VDD) U28.1(VDD_IO) U28.7(~{CS}) U29.2(VDD) U29.4(S1) U29.13(VDDIO)
5V: C75.2 F5.1 U30.1(VIN) U30.3(ON/~{OFF})
5VA: C54.2 C55.2 C60.2 U23.2(VS) U24.2(VS)
GND: C58.1 C59.1 C63.1 C64.1 C65.1 C69.1 C70.1 C71.1 C72.1 C73.2 C74.2 C75.1 C76.1 C77.1 C78.1 P8.2(Y) R42.2 R48.2 U22.13(GND) U22.14(GND) U22.15(GND) U25.8(R-_GND) U25.9(R-_GND) U25.10(R-_GND) U25.11(R-_GND) U25.12(R-_GND) U25.13(GND) U26.10(GND) U26.12(GND) U26.13(GND) U26.24(GND) U28.2(GND) U28.4(GND) U28.5(GND) U28.12(SDO/ALT_ADDRESS) U29.9(GND) U29.11(GND) U30.2(GND)
VDDA: C66.2 U27.4(VDD)
VS: C64.2 C72.2 C76.2 U25.16(VDD) U28.6(Vs) U30.5(VOUT)
VSSA: C54.1 C55.1 C56.1 C57.1 C60.1 C61.1 C62.1 C66.1 C67.1 R35.2 R37.2 U23.3(GND) U24.3(GND) U27.2(GND)
~{IMU_RESET}: U22.8(~{RST}) ; port SINT.~{IMU_RESET}
ACC_INT1: U28.8(INT1) ; port SINT.ACC_INT1
ACC_INT2: U28.9(INT2) ; port SINT.ACC_INT2
BARO: C56.2 R34.2 R35.1 ; port ADC.AN0
BATT_DIV: C78.2 R47.2 R48.1 ; port ADC.AN3
BATT_IN: R47.1
GYRO_DRDY: U25.6(DRDY/INT2) ; port SINT.GYRO_INT2
GYRO_INT1: U25.7(INT1) ; port SINT.GYRO_INT1
HMC_DRDY: U29.15(DRDY) ; port SINT.HMC_DRDY
IMU_ADC: U22.21(AUX_ADC)
IMU_DAC: U22.20(AUX_DAC)
IMU_DIO1: U22.7(DIO1) ; port SINT.IMU_DIO1
IMU_DIO2: U22.9(DIO2) ; port SINT.IMU_DIO2
IMU_DIO3: U22.1(DIO3)
IMU_DIO4: U22.2(DIO4/CLKIN)
MISO: U22.4(DOUT) ; port SPI.MISO
MOSI: U22.5(DIN) ; port SPI.MOSI
PITOT: C61.2 R36.2 R37.1 ; port ADC.AN1
RXD2: R41.2 U26.21(RXD0) ; port UART2.RXD
SCK: U22.3(SCLK) ; port SPI.SCK
SCL0: R38.2 U25.2(SCL/SPC) ; port I2C0.SCL
SCL1: R44.2 U28.14(SCL/SCLK) ; port I2C1.SCL
SCL2: R45.1 U29.1(SCL) ; port I2C2.SCL
SDA0: R39.2 U25.3(SDA/SDI/SDO) ; port I2C0.SDA
SDA1: R43.2 U28.13(SDA/SDI/SDIO) ; port I2C1.SDA
SDA2: R46.1 U29.16(SDA) ; port I2C2.SDA
SSEL: U22.6(~{CS}) ; port SPI.SSEL
THERM: C67.2 U27.3(VOUT) ; port ADC.AN2
TXD2: R40.2 U26.20(TXD0) ; port UART2.TXD
NetC57_2: C57.2 R34.1 U23.4(VOUT)
NetC58_2: C58.2 C59.2 F5.2 U22.10(VDD) U22.11(VDD) U22.12(VDD)
NetC62_2: C62.2 R36.1 U24.4(VOUT)
NetC65_2: C65.2 C68.2 U25.14(PLLFILT)
NetC68_1: C68.1 R42.1
NetC69_2: C69.2 C70.2 F6.2 U26.22(V_BCKP) U26.23(VCC)
NetC74_1: C74.1 U29.10(C1)
NetC77_2: C77.2 U29.8(SETP)
NetP8_1: P8.1(X) U26.11(RF_IN)

Not connected (* = marked no-connect by the designer): U22 16(DNC)* 17(DNC)* 18(DNC)* 19(DNC)* 22(DNC)* 23(DNC)* 24(DNC)*; U23 1(NC) 5(NC) 6(NC) 7(NC) 8(NC); U24 1(NC) 5(NC) 6(NC) 7(NC) 8(NC); U26 1(NC)* 2(SS_N)* 3(PPS)* 4(EXTINT0)* 5(USB_DM)* 6(USB_DP)* 7(VDDUSB)* 8(NC)* 9(VCC_RF)* 14(MOSI)* 15(MISO)* 16(SCK)* 17(NC)* 18(SDA)* 19(SCL)*; U27 1(NC) 5(NC); U28 3(R_-_Vs)* 10(NC)* 11(R_-_GND)*; U29 3(NC) 5(NC) 6(NC) 7(NC) 12(SETC) 14(NC); U30 4(NC)

### Notes on the sheet
- (near R34) SENSOR DE PRESION BAROMETRICA - ALTIMETRO
- (near U22) IMU
- ACELER
- GYRO
- ADIS
- MAGNET
- GPS INT
- ANALOG
- I2C ADDRESS: 0b1101001 = 0x69
- (near U25) READ ADDRESS: 0xD3
- WRITE ADDRESS: 0xD2
- GPS INTERNO
- I2C ADDRESS: 0x53
- MAGNETROMETRO
- (near U28) WRITE ADDRESS: 0xA6
- (near U28) READ ADDRESS: 0xA7
- COMPROBAR ALIMENTACION SENSORES
- SENSORES
- epf
- (in symbol ADXL345) 0: SPI 1:I2C
- (in symbol L3G4200D) 0: SPI 1:I2C

### Library data of the parts
C54-C78 = Cap
R34-R44 R47 R48 = Res
R45 R46 = Res: Value: 2.2k
U23 = MPXH6115A: ABSOLUTE PRESSURE SENSOR
U24 = MPXV5004A: Differential Pressure Sensor
U25 = L3G4200D: 3 axis gyroscope
U26 = SKG12A: MODULO GPS DE SkyNav
U27 = MCP9700A: SENSOR DE TEMPERATURA
U28 = ADXL345: Digital Accelerometer
U30 = LP2980: Current 50mA

## Sheet SensorDSC.SchDoc
size A4
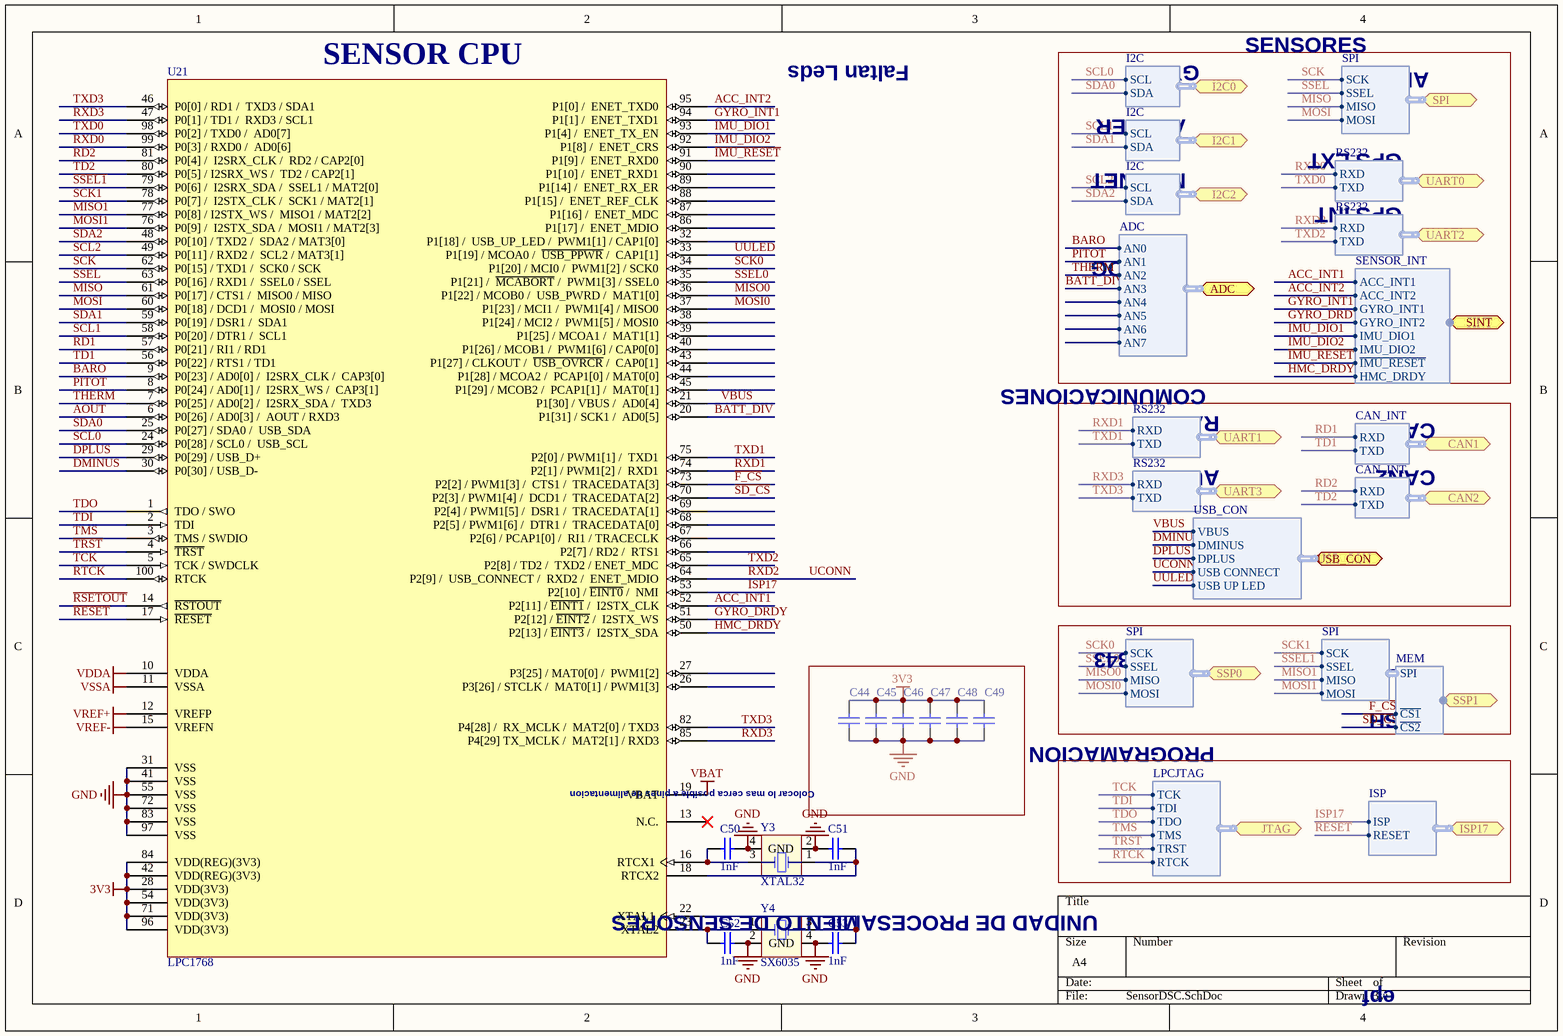
[diagram p5: SensorDSC.SchDoc]

### Parts
C44  Capacitor  [CAP0402]  (value not drawn)
C45  Capacitor  [CAP0402]  (value not drawn)
C46  Capacitor  [CAP0402]  (value not drawn)
C47  Capacitor  [CAP0402]  (value not drawn)
C48  Capacitor  [CAP0402]  (value not drawn)
C49  Capacitor  [CAP0402]  (value not drawn)
C50  value 1nF  [CAP0402]  (hidden comment: Capacitor)
C51  value 1nF  [CAP0402]  (hidden comment: Capacitor)
C52  value 1nF  [CAP0402]  (hidden comment: Capacitor)
C53  value 1nF  [CAP0402]  (hidden comment: Capacitor)
U21  LPC1768  [SOT407-1 LPC1768]
Y3  XTAL32  [XTAL32]
Y4  SX6035  [SX6035]

### Blocks framed on the sheet
Colocar lo mas cerca posible a pines de alimentacion: C44-C49

### Ports
ADC (harness ADC), CAN1 (harness CAN_INT), CAN2 (harness CAN_INT), I2C0 (harness I2C), I2C1 (harness I2C), I2C2 (harness I2C), ISP17 (harness ISP), JTAG (harness LPCJTAG), SINT (harness SENSOR_INT), SPI (harness SPI), SSP0 (harness SPI), SSP1 (harness MEM), UART0 (harness RS232), UART1 (harness RS232), UART2 (harness RS232), UART3 (harness RS232), USB_CON (harness USB_CON)

### Harnesses
CAN_INT: RXD, TXD
LPCJTAG: TCK, TDI, TDO, TMS, TRST, RTCK
I2C: SCL, SDA
RS232: RXD, TXD
ISP: ISP, RESET
SPI: SCK, SSEL, MISO, MOSI
ADC: AN0, AN1, AN2, AN3, AN4, AN5, AN6, AN7
USB_CON: DMINUS, DPLUS, VBUS, USB CONNECT, USB UP LED
MEM: SPI, ~{CS1}, ~{CS2}
SENSOR_INT: ACC_INT1, ACC_INT2, GYRO_INT1, GYRO_INT2, IMU_DIO1, IMU_DIO2, ~{IMU_RESET}, HMC_DRDY

### Nets
3V3: C44.2 C45.2 C46.2 C47.2 C48.2 C49.2 U21.28(VDD(3V3)) U21.42(VDD(REG)(3V3)) U21.54(VDD(3V3)) U21.71(VDD(3V3)) U21.84(VDD(REG)(3V3)) U21.96(VDD(3V3))
GND: C44.1 C45.1 C46.1 C47.1 C48.1 C49.1 C50.1 C51.2 C52.1 C53.2 U21.31(VSS) U21.41(VSS) U21.55(VSS) U21.72(VSS) U21.83(VSS) U21.97(VSS) Y3.2(GND) Y3.4(GND) Y4.2(GND) Y4.4(GND)
VBAT: U21.19(VBAT)
VDDA: U21.10(VDDA)
VREF+: U21.12(VREFP)
VREF-: U21.15(VREFN)
VSSA: U21.11(VSSA)
~{F_CS}: U21.73(P2[2]_/_PWM1[3]_/__CTS1_/__TRACEDATA[3]) ; port SSP1.~{CS1}
~{IMU_RESET}: U21.91(P1[9]_/__ENET_RXD0) ; port SINT.~{IMU_RESET}
~{RESET}: U21.17(~{RESET}) ; port ISP17.RESET
~{RSETOUT}: U21.14(~{RSTOUT})
~{SD_CS}: U21.70(P2[3]_/_PWM1[4]_/__DCD1_/__TRACEDATA[2]) ; port SSP1.~{CS2}
~{SSEL1}: U21.79(P0[6]_/__I2SRX_SDA_/__SSEL1_/_MAT2[0]) ; harness SPI.SSEL
~{TRST}: U21.4(~{TRST}) ; port JTAG.TRST
ACC_INT1: U21.52(P2[11]_/_~{EINT1}_/__I2STX_CLK) ; port SINT.ACC_INT1
ACC_INT2: U21.95(P1[0]_/__ENET_TXD0) ; port SINT.ACC_INT2
AOUT: U21.6(P0[26]_/_AD0[3]_/__AOUT_/_RXD3)
BARO: U21.9(P0[23]_/_AD0[0]_/__I2SRX_CLK_/__CAP3[0]) ; port ADC.AN0
BATT_DIV: U21.20(P1[31]_/_SCK1_/__AD0[5]) ; port ADC.AN3
DMINUS: U21.30(P0[30]_/_USB_D-) ; port USB_CON.DMINUS
DPLUS: U21.29(P0[29]_/_USB_D+) ; port USB_CON.DPLUS
GYRO_DRDY: U21.51(P2[12]_/_~{EINT2}_/__I2STX_WS) ; port SINT.GYRO_INT2
GYRO_INT1: U21.94(P1[1]_/__ENET_TXD1) ; port SINT.GYRO_INT1
HMC_DRDY: U21.50(P2[13]_/_~{EINT3}_/__I2STX_SDA) ; port SINT.HMC_DRDY
IMU_DIO1: U21.93(P1[4]_/__ENET_TX_EN) ; port SINT.IMU_DIO1
IMU_DIO2: U21.92(P1[8]_/__ENET_CRS) ; port SINT.IMU_DIO2
ISP17: U21.53(P2[10]_/_~{EINT0}_/__NMI) ; port ISP17.ISP
MISO: U21.61(P0[17]_/_CTS1_/__MISO0_/_MISO) ; port SPI.MISO
MISO0: U21.36(P1[22]_/_MCOB0_/__USB_PWRD_/__MAT1[0]) ; port SSP0.MISO  [project net LPC13_MISO0]
MISO1: U21.77(P0[8]_/_I2STX_WS_/__MISO1_/_MAT2[2]) ; harness SPI.MISO
MOSI: U21.60(P0[18]_/_DCD1_/__MOSI0_/_MOSI) ; port SPI.MOSI
MOSI0: U21.37(P1[23]_/_MCI1_/__PWM1[4]_/_MISO0) ; port SSP0.MOSI  [project net LPC13_MOSI0]
MOSI1: U21.76(P0[9]_/__I2STX_SDA_/__MOSI1_/_MAT2[3]) ; harness SPI.MOSI
PITOT: U21.8(P0[24]_/_AD0[1]_/__I2SRX_WS_/__CAP3[1]) ; port ADC.AN1
RD1: U21.57(P0[21]_/_RI1_/_RD1) ; port CAN1.RXD
RD2: U21.81(P0[4]_/__I2SRX_CLK_/__RD2_/_CAP2[0]) ; port CAN2.RXD
RTCK: U21.100(RTCK) ; port JTAG.RTCK
RXD0: U21.99(P0[3]_/_RXD0_/__AD0[6]) ; port UART0.RXD
RXD1: U21.74(P2[1]_/_PWM1[2]_/__RXD1) ; port UART1.RXD
RXD2: U21.64(P2[9]_/__USB_CONNECT_/__RXD2_/__ENET_MDIO) ; port UART2.RXD, port USB_CON.USB CONNECT  [also labelled UCONN]
RXD3: U21.47(P0[1]_/_TD1_/__RXD3_/_SCL1) U21.85(P4[29]_TX_MCLK_/__MAT2[1]_/_RXD3) ; port UART3.RXD
SCK: U21.62(P0[15]_/_TXD1_/__SCK0_/_SCK) ; port SPI.SCK
SCK0: U21.34(P1[20]_/_MCI0_/__PWM1[2]_/_SCK0) ; port SSP0.SCK  [project net LPC13_SCK0]
SCK1: U21.78(P0[7]_/__I2STX_CLK_/__SCK1_/_MAT2[1]) ; harness SPI.SCK
SCL0: U21.24(P0[28]_/_SCL0_/__USB_SCL) ; port I2C0.SCL
SCL1: U21.58(P0[20]_/_DTR1_/__SCL1) ; port I2C1.SCL
SCL2: U21.49(P0[11]_/_RXD2_/__SCL2_/_MAT3[1]) ; port I2C2.SCL
SDA0: U21.25(P0[27]_/_SDA0_/__USB_SDA) ; port I2C0.SDA
SDA1: U21.59(P0[19]_/_DSR1_/__SDA1) ; port I2C1.SDA
SDA2: U21.48(P0[10]_/_TXD2_/__SDA2_/_MAT3[0]) ; port I2C2.SDA
SSEL: U21.63(P0[16]_/_RXD1_/__SSEL0_/_SSEL) ; port SPI.SSEL
SSEL0: U21.35(P1[21]_/__~{MCABORT}_/__PWM1[3]_/_SSEL0) ; port SSP0.SSEL  [project net LPC13_SSEL0]
TCK: U21.5(TCK_/_SWDCLK) ; port JTAG.TCK
TD1: U21.56(P0[22]_/_RTS1_/_TD1) ; port CAN1.TXD
TD2: U21.80(P0[5]_/_I2SRX_WS_/__TD2_/_CAP2[1]) ; port CAN2.TXD
TDI: U21.2(TDI) ; port JTAG.TDI
TDO: U21.1(TDO_/_SWO) ; port JTAG.TDO
THERM: U21.7(P0[25]_/_AD0[2]_/__I2SRX_SDA_/__TXD3) ; port ADC.AN2
TMS: U21.3(TMS_/_SWDIO) ; port JTAG.TMS
TXD0: U21.98(P0[2]_/_TXD0_/__AD0[7]) ; port UART0.TXD
TXD1: U21.75(P2[0]_/_PWM1[1]_/__TXD1) ; port UART1.TXD
TXD2: U21.65(P2[8]_/_TD2_/__TXD2_/_ENET_MDC) ; port UART2.TXD
TXD3: U21.46(P0[0]_/_RD1_/__TXD3_/_SDA1) U21.82(P4[28]_/__RX_MCLK_/__MAT2[0]_/_TXD3) ; port UART3.TXD
UULED: U21.33(P1[19]_/_MCOA0_/__~{USB_PPWR}_/__CAP1[1]) ; port USB_CON.USB UP LED
VBUS: U21.21(P1[30]_/_VBUS_/__AD0[4]) ; port USB_CON.VBUS
NetC50_2: C50.2 U21.16(RTCX1) Y3.3(XTAL)
NetC51_1: C51.1 U21.18(RTCX2) Y3.1(XTAL)
NetC52_2: C52.2 U21.23(XTAL2) Y4.1(XTAL)
NetC53_1: C53.1 U21.22(XTAL1) Y4.3(XTAL)

Not connected (* = marked no-connect by the designer): U21 13(N.C.)* 26(P3[26]_/_STCLK_/__MAT0[1]_/_PWM1[3]) 27(P3[25]_/_MAT0[0]_/__PWM1[2]) 32(P1[18]_/__USB_UP_LED_/__PWM1[1]_/_CAP1[0]) 38(P1[24]_/_MCI2_/__PWM1[5]_/_MOSI0) 39(P1[25]_/_MCOA1_/__MAT1[1]) 40(P1[26]_/_MCOB1_/__PWM1[6]_/_CAP0[0]) 43(P1[27]_/_CLKOUT_/__~{USB_OVRCR}_/__CAP0[1]) 44(P1[28]_/_MCOA2_/__PCAP1[0]_/_MAT0[0]) 45(P1[29]_/_MCOB2_/__PCAP1[1]_/__MAT0[1]) 66(P2[7]_/_RD2_/__RTS1) 67(P2[6]_/_PCAP1[0]_/__RI1_/_TRACECLK) 68(P2[5]_/_PWM1[6]_/__DTR1_/__TRACEDATA[0]) 69(P2[4]_/_PWM1[5]_/__DSR1_/__TRACEDATA[1]) 86(P1[17]_/__ENET_MDIO) 87(P1[16]_/__ENET_MDC) 88(P1[15]_/__ENET_REF_CLK) 89(P1[14]_/__ENET_RX_ER) 90(P1[10]_/__ENET_RXD1)

### Notes on the sheet
- (near U21) SENSOR CPU
- Faltan Leds
- ACELER
- GYRO
- SENSORES
- ADIS
- MAGNET
- GPS EXT
- ANALOG
- GPS INT
- COMUNICACIONES
- RADIO
- CAN1
- AUX
- CAN2
- LPC1343
- SD_CARD
- FLASH
- PROGRAMACION
- UNIDAD DE PROCESAMIENTO DE SENSORES
- epf

### Library data of the parts
C44-C49 = Cap: Value: 100nF
C50-C53 = Cap
U21 = LPC1768FBD100: ARM CortexM3 512K Flash, 64k RAM, CAN, USB, Ethernet, DAC; Code_IEC: 136E05; Published: 31-Jul-2006; DatasheetVersion: rev.01, Jan-2006; PackageVersion: Feb-2003; PackageReference: SOT313-2; Publisher: Altium Limited; PackageDescription: 48-Pin Plastic Low Profile Quad Flat Pack; Code_JEDEC: MS-026; ComponentLink1Description: Manufacturer Link; ComponentLink1URL: http://www.nxp.com/; ComponentLink2Description: Datasheet; ComponentLink2URL: http://www.standardics.nxp.com/products/lpc2000/datasheet/lpc2101.lpc2102.lpc2103.pdf
Y3 = XTAL32: Crystal Oscillator; Published: 8-Jun-2000; LatestRevisionDate: 17-Jul-2002; LatestRevisionNote: Re-released for DXP Platform.; PackageReference: R38; Publisher: Altium Limited
Y4 = XTAL_SX6035

## Nets that join several sheets
3V3: Power (5 pins), Comunicaciones (22 pins), RC_Interface (P5.1 U18.8 U18.44), OSD y Memoria (7 pins), Sensores (21 pins), SensorDSC (12 pins)
5V: Power (C31.2 U13.1), Comunicaciones (P1.1), RC_Interface (U17.17 U19.16 U20.16), OSD y Memoria (9 pins), Sensores (C75.2 F5.1 U30.1 U30.3)
5VA: Power (C35.2 U15.5), Sensores (5 pins)
GND: Power (21 pins), Comunicaciones (47 pins), RC_Interface (17 pins), OSD y Memoria (15 pins), Sensores (38 pins), SensorDSC (20 pins)
VBAT: Power (D10.3), SensorDSC (U21.19)
VDDA: Power (5 pins), Sensores (C66.2 U27.4), SensorDSC (U21.10)
VREF+: Power (C40.2 C41.2 F3.2), SensorDSC (U21.12)
VREF-: Power (C40.1 C41.1 F4.2), SensorDSC (U21.15)
Vservo: Power (C28.1 D8.1), RC_Interface (P6.1 P6.2)
VSSA: Power (5 pins), Sensores (14 pins), SensorDSC (U21.11)
~{F_CS}: OSD y Memoria (U7.1), SensorDSC (U21.73)
~{IMU_RESET}: Sensores (U22.8), SensorDSC (U21.91)
~{RESET}: Comunicaciones (7 pins), RC_Interface (U18.3), OSD y Memoria (U6.3 U8.19), SensorDSC (U21.17)
~{SD_CS}: OSD y Memoria (U10.1), SensorDSC (U21.70)
~{SSEL1}: OSD y Memoria (U7.2 U10.2), SensorDSC (U21.79)
~{TRST}: Comunicaciones (P2.3 R9.2), SensorDSC (U21.4)
ACC_INT1: Sensores (U28.8), SensorDSC (U21.52)
ACC_INT2: Sensores (U28.9), SensorDSC (U21.95)
BARO: Sensores (C56.2 R34.2 R35.1), SensorDSC (U21.9)
BATT_DIV: Sensores (C78.2 R47.2 R48.1), SensorDSC (U21.20)
DMINUS: Comunicaciones (R13.2), SensorDSC (U21.30)
DPLUS: Comunicaciones (R14.2), SensorDSC (U21.29)
GYRO_DRDY: Sensores (U25.6), SensorDSC (U21.51)
GYRO_INT1: Sensores (U25.7), SensorDSC (U21.94)
HMC_DRDY: Sensores (U29.15), SensorDSC (U21.50)
IMU_DIO1: Sensores (U22.7), SensorDSC (U21.93)
IMU_DIO2: Sensores (U22.9), SensorDSC (U21.92)
ISP13: Comunicaciones (Q2.3 R3.1), RC_Interface (U18.4)
ISP17: Comunicaciones (C12.1 Q1.3 R2.1 S2.2), SensorDSC (U21.53)
LPC13_MISO0: RC_Interface (U18.27), SensorDSC (U21.36)
LPC13_MISO1: RC_Interface (U18.26), OSD y Memoria (U8.11)
LPC13_MOSI0: RC_Interface (U18.28), SensorDSC (U21.37)
LPC13_MOSI1: RC_Interface (U18.38), OSD y Memoria (U8.9)
LPC13_RXD: Comunicaciones (U2.12), RC_Interface (U18.46)
LPC13_SCK0: RC_Interface (U18.29), SensorDSC (U21.34)
LPC13_SCK1: RC_Interface (U18.13), OSD y Memoria (U8.10)
LPC13_SSEL0: RC_Interface (U18.10), SensorDSC (U21.35)
LPC13_SSEL1: RC_Interface (U18.2), OSD y Memoria (U8.8)
LPC13_TXD: Comunicaciones (U2.11), RC_Interface (U18.47)
MISO: Sensores (U22.4), SensorDSC (U21.61)
MISO1: OSD y Memoria (U6.8 U9.7), SensorDSC (U21.77)
MOSI: Sensores (U22.5), SensorDSC (U21.60)
MOSI1: OSD y Memoria (U6.1 U9.3), SensorDSC (U21.76)
PITOT: Sensores (C61.2 R36.2 R37.1), SensorDSC (U21.8)
RD1: Comunicaciones (U3.4), SensorDSC (U21.57)
RD2: Comunicaciones (U5.4), SensorDSC (U21.81)
RTCK: Comunicaciones (P2.11 R20.1), SensorDSC (U21.100)
RXD0: Comunicaciones (U1.12), SensorDSC (U21.99)
RXD1: Comunicaciones (U1.9), SensorDSC (U21.74)
RXD2: Comunicaciones (R18.2), Sensores (R41.2 U26.21), SensorDSC (U21.64)
RXD3: Comunicaciones (U2.9), SensorDSC (U21.47 U21.85)
SCK: Sensores (U22.3), SensorDSC (U21.62)
SCK1: OSD y Memoria (U6.2 U9.5), SensorDSC (U21.78)
SCL0: Sensores (R38.2 U25.2), SensorDSC (U21.24)
SCL1: Sensores (R44.2 U28.14), SensorDSC (U21.58)
SCL2: Sensores (R45.1 U29.1), SensorDSC (U21.49)
SDA0: Sensores (R39.2 U25.3), SensorDSC (U21.25)
SDA1: Sensores (R43.2 U28.13), SensorDSC (U21.59)
SDA2: Sensores (R46.1 U29.16), SensorDSC (U21.48)
SSEL: Sensores (U22.6), SensorDSC (U21.63)
TCK: Comunicaciones (P2.9 R12.2), SensorDSC (U21.5)
TD1: Comunicaciones (U3.1), SensorDSC (U21.56)
TD2: Comunicaciones (U5.1), SensorDSC (U21.80)
TDI: Comunicaciones (P2.5 R10.2), SensorDSC (U21.2)
TDO: Comunicaciones (P2.13 R21.1), SensorDSC (U21.1)
THERM: Sensores (C67.2 U27.3), SensorDSC (U21.7)
TMS: Comunicaciones (P2.7 R11.2), SensorDSC (U21.3)
TXD0: Comunicaciones (U1.11), SensorDSC (U21.98)
TXD1: Comunicaciones (U1.10), SensorDSC (U21.75)
TXD2: Sensores (R40.2 U26.20), SensorDSC (U21.65)
TXD3: Comunicaciones (U2.10), SensorDSC (U21.46 U21.82)
UULED: Comunicaciones (R19.2), SensorDSC (U21.33)
VBUS: Comunicaciones (U4.1), SensorDSC (U21.21)